# Altium project inno_Bottom_borad.PrjPcb
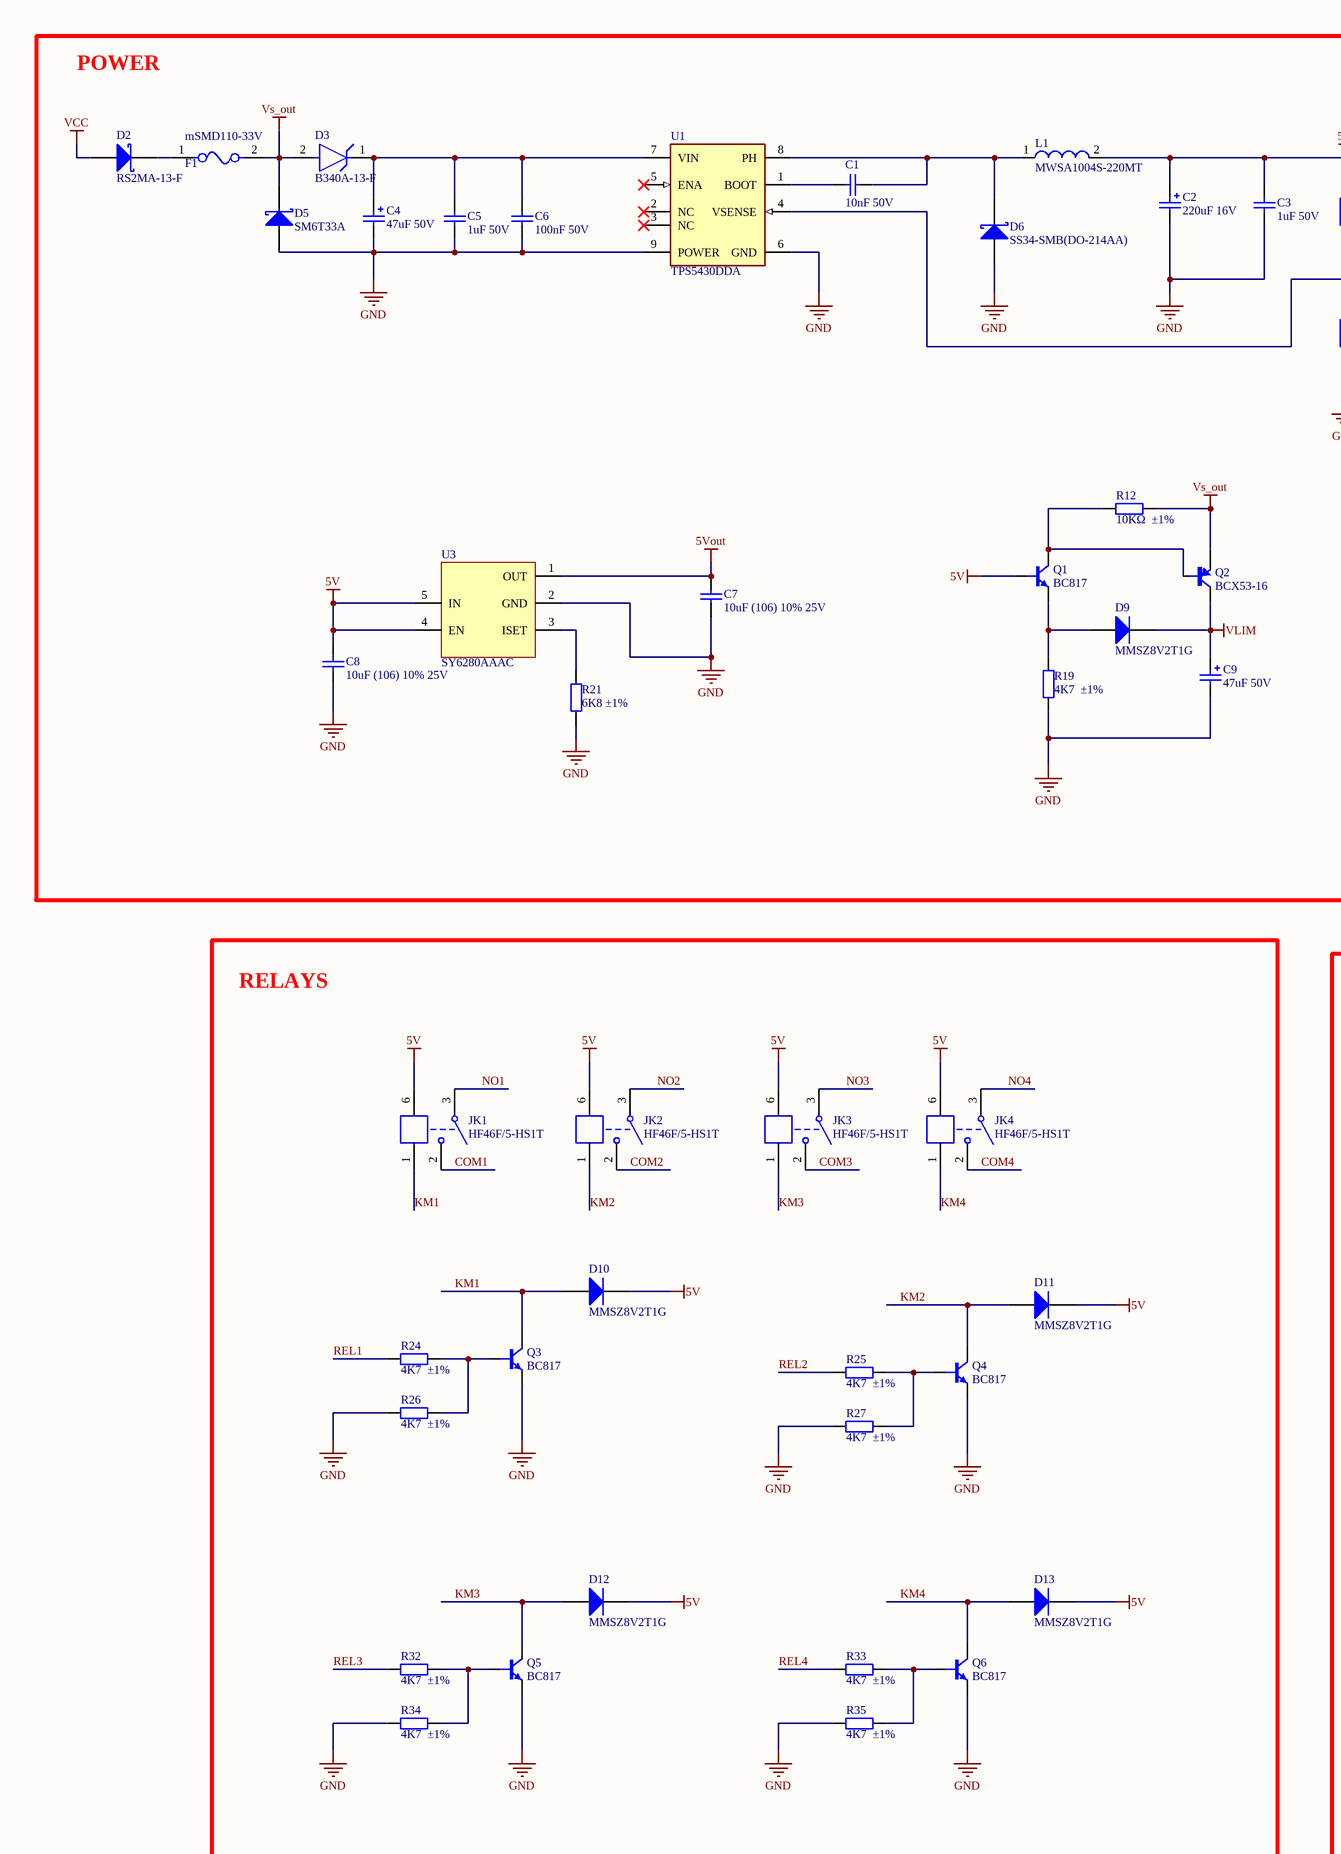
[diagram p0: BottomBoard.SchDoc, left]
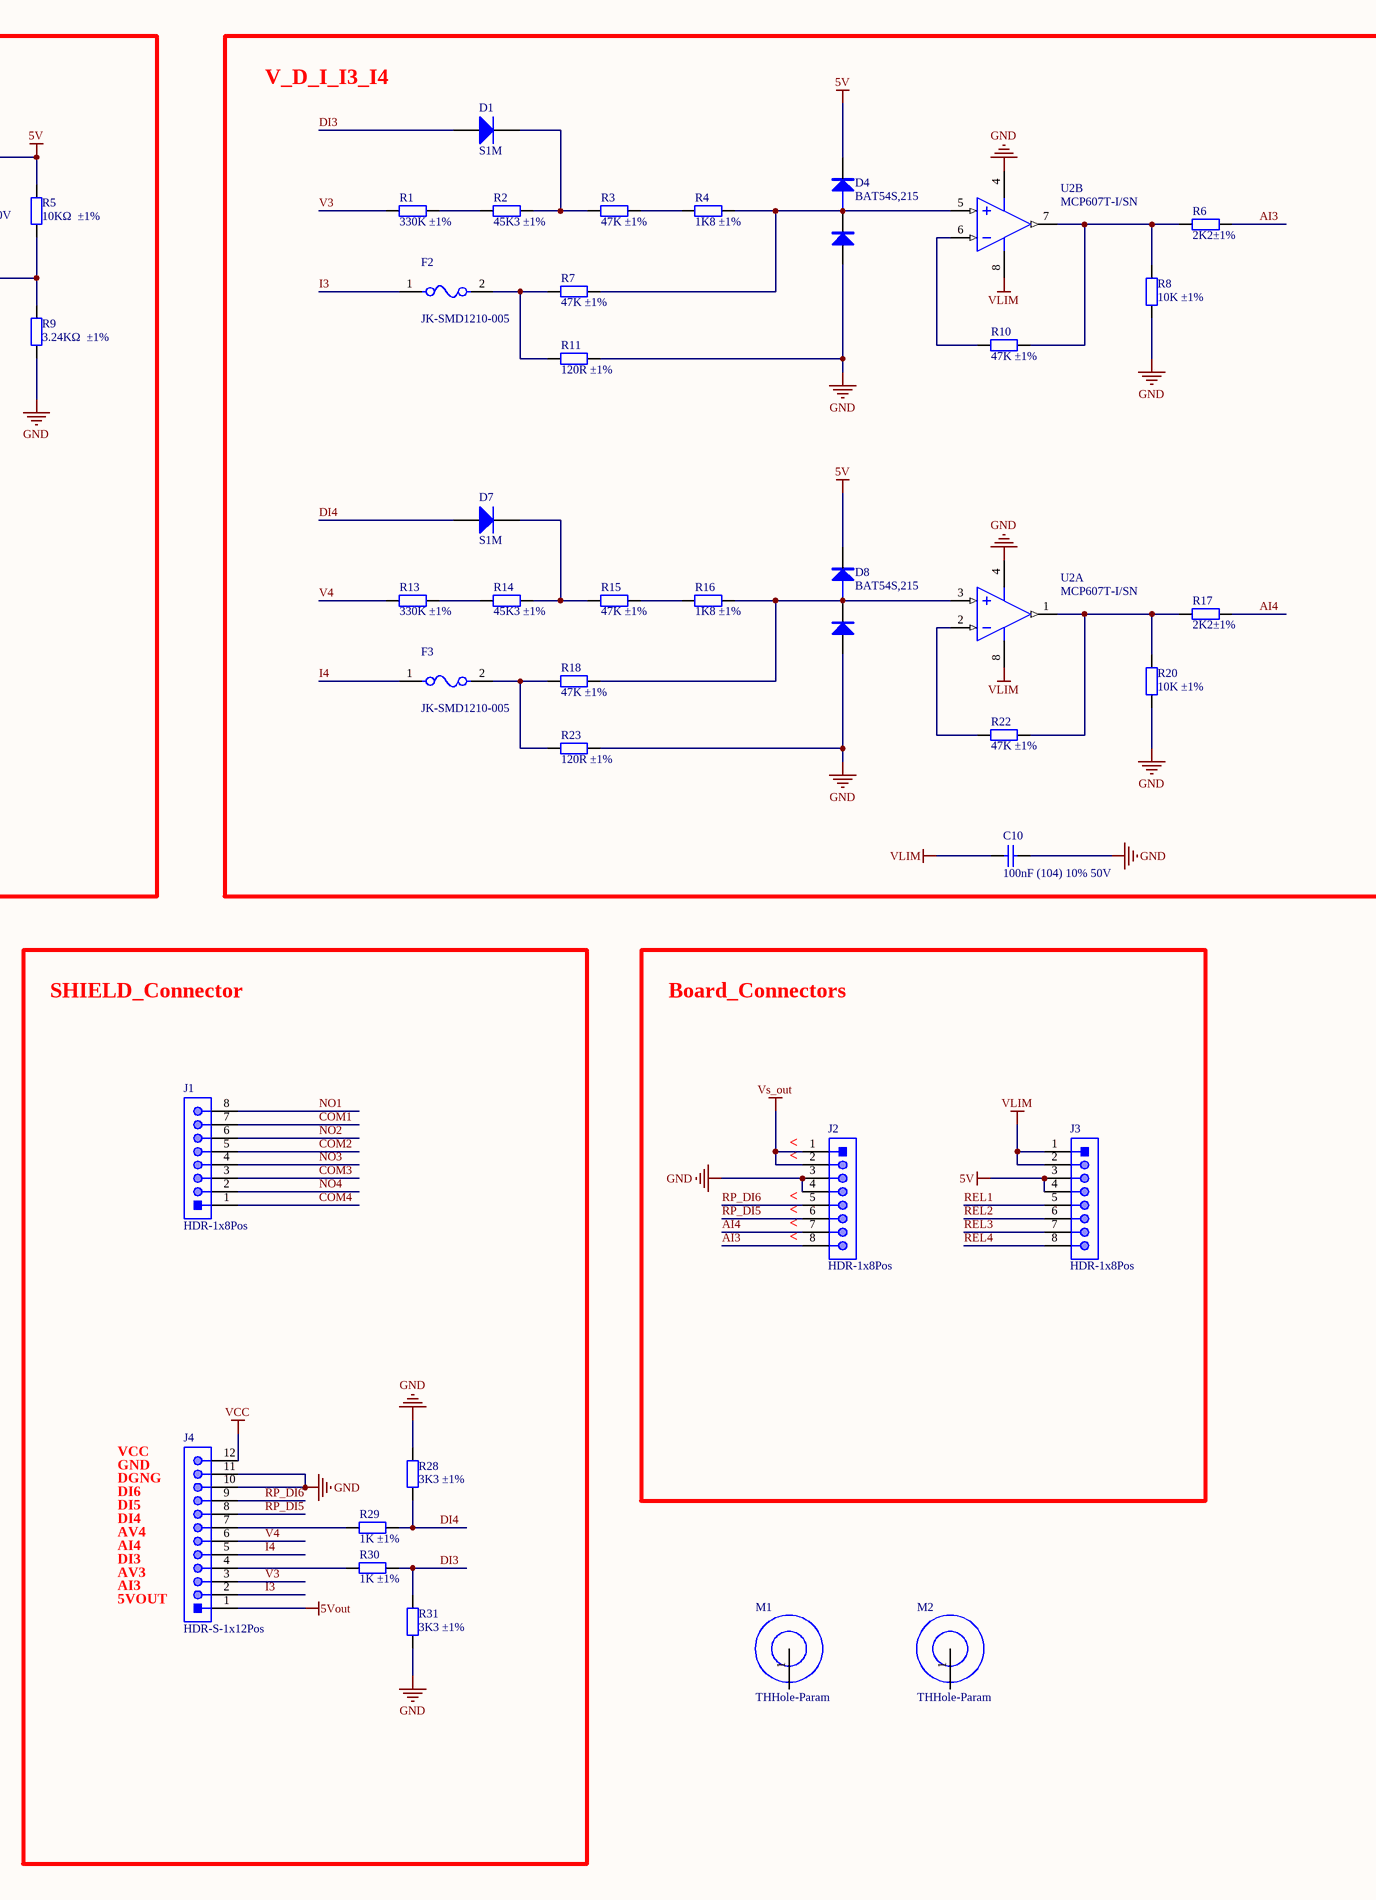
[diagram p1: BottomBoard.SchDoc, right]
2 sheets, 81 parts. Net scope: global (net labels, ports and power ports of the same name join across sheets).
Board file: iono_bottom_pico.PcbDoc
Sheets:
  SheetStruct.SchDoc
  BottomBoard.SchDoc

## Sheet SheetStruct.SchDoc
size A4

## Sheet BottomBoard.SchDoc
size A2

### Parts
C1  10nF 50V  [0402_C]
C2  220uF 16V  [SMD-EC-F8]
C3  1uF 50V  [0603_C]
C4  47uF 50V  [SMD-EC-F6.3]
C5  1uF 50V  [0603_C]
C6  100nF 50V  [0402_C]
C7  10uF (106) 10% 25V  [0603_C]
C8  10uF (106) 10% 25V  [0603_C]
C9  47uF 50V  [SMD-EC-F6.3]
C10  100nF (104) 10% 50V  [0402_C]
D1  S1M  [DO-214AC]
D2  RS2MA-13-F  [DIOD-SMA-1K]
D3  B340A-13-F  [DO-214AC]
D4  BAT54S,215  [SOT-23-3]
D5  SM6T33A  [DO-214AA]
D6  SS34-SMB(DO-214AA)  [DO-214AA]
D7  S1M  [DO-214AC]
D8  BAT54S,215  [SOT-23-3]
D9  MMSZ8V2T1G  [SOD-123-1A]
D10  MMSZ8V2T1G  [SOD-123-1A]
D11  MMSZ8V2T1G  [SOD-123-1A]
D12  MMSZ8V2T1G  [SOD-123-1A]
D13  MMSZ8V2T1G  [SOD-123-1A]
F1  mSMD110-33V  [1812_R]
F2  JK-SMD1210-005  [1210_R]
F3  JK-SMD1210-005  [1210_R]
J1  HDR-1x8Pos  [KF2EDG3.50-8H]
J2  HDR-1x8Pos  [Pin Header 1x8 TH Pitch 2.54mm]
J3  HDR-1x8Pos  [Pin Header 1x8 TH Pitch 2.54mm]
J4  HDR-S-1x12Pos  [KF2EDGK-2.54-WI-12P]
JK1  HF46F/5-HS1T  [RELAY-TH_HF46F-5-HS1T]
JK2  HF46F/5-HS1T  [RELAY-TH_HF46F-5-HS1T]
JK3  HF46F/5-HS1T  [RELAY-TH_HF46F-5-HS1T]
JK4  HF46F/5-HS1T  [RELAY-TH_HF46F-5-HS1T]
L1  MWSA1004S-220MT  [MWSA1004S]
M1  THHole-Param  [MTG300_600]
M2  THHole-Param  [MTG300_600]
Q1  BC817  [SOT-23-3]
Q2  BCX53-16  [SOT89_M]
Q3  BC817  [SOT-23-3]
Q4  BC817  [SOT-23-3]
Q5  BC817  [SOT-23-3]
Q6  BC817  [SOT-23-3]
R1  330K ±1%  [0402_R]
R2  45K3 ±1%  [0402_R]
R3  47K ±1%  [0402_R]
R4  1K8 ±1%  [0402_R]
R5  10KΩ  ±1%  [0402_R]
R6  2K2±1%  [0402_R]
R7  47K ±1%  [0402_R]
R8  10K ±1%  [0402_R]
R9  3.24KΩ  ±1%  [0402_R]
R10  47K ±1%  [0402_R]
R11  120R ±1%  [RS 1/4W-V3]
R12  10KΩ  ±1%  [0402_R]
R13  330K ±1%  [0402_R]
R14  45K3 ±1%  [0402_R]
R15  47K ±1%  [0402_R]
R16  1K8 ±1%  [0402_R]
R17  2K2±1%  [0402_R]
R18  47K ±1%  [0402_R]
R19  4K7  ±1%  [0402_R]
R20  10K ±1%  [0402_R]
R21  6K8 ±1%  [0402_R]
R22  47K ±1%  [0402_R]
R23  120R ±1%  [RS 1/4W-V3]
R24  4K7  ±1%  [0402_R]
R25  4K7  ±1%  [0402_R]
R26  4K7  ±1%  [0402_R]
R27  4K7  ±1%  [0402_R]
R28  3K3 ±1%  [0402_R]
R29  1K ±1%  [0402_R]
R30  1K ±1%  [0402_R]
R31  3K3 ±1%  [0402_R]
R32  4K7  ±1%  [0402_R]
R33  4K7  ±1%  [0402_R]
R34  4K7  ±1%  [0402_R]
R35  4K7  ±1%  [0402_R]
U1  TPS5430DDA  [DDA0008J_L]
U2  MCP607T-I/SN  [D0008A_L]  (parts A,B of 2)
U3  SY6280AAAC  [SOT-23-5]

### Blocks framed on the sheet
POWER: C1-C9 D2 D3 D5 D6 D9 F1 L1 Q1 Q2 R5 R9 R12 R19 R21 U1 U3
V_D_I_I3_I4: C10 D1 D4 D7 D8 F2 F3 R1-R4 R6-R8 R10 R11 R13-R18 R20 R22 R23 U2
RELAYS: D10-D13 JK1-JK4 Q3-Q6 R24-R27 R32-R35
SHIELD_Connector: J1 J4 R28-R31
Board_Connectors: J2 J3

### Nets
5V: C2.1 C3.2 C8.2 D4.2 D8.2 D10.1(K) D11.1(K) D12.1(K) D13.1(K) J3.3 J3.4 JK1.6 JK2.6 JK3.6 JK4.6 L1.2 Q1.1(B) R5.2 U3.4(EN) U3.5(IN)
5Vout: C7.2 J4.1 U3.1(OUT)
GND: C2.2 C3.1 C4.2 C5.1 C6.1 C7.1 C8.1 C9.2 C10.2 D4.1 D5.2(A) D6.2(A) D8.1 J2.3 J2.4 J4.10 J4.11 Q3.2(E) Q4.2(E) Q5.2(E) Q6.2(E) R8.2 R9.1 R11.1 R19.2 R20.2 R21.1 R23.1 R26.1 R27.1 R28.1 R31.1 R34.1 R35.1 U1.6(GND) U1.9(POWER) U2.4(GND) U3.2(GND)
VCC: D2.2(A) J4.12
VLIM: C9.1 C10.1 D9.1(K) J3.1 J3.2 Q2.3(C) U2.8(VCC)
Vs_out: D3.2(A) D5.1(K) F1.2 J2.1 J2.2 Q2.2(E) R12.1
AI3: J2.8 R6.2
AI4: J2.7 R17.2
COM1: J1.7 JK1.2
COM2: J1.5 JK2.2
COM3: J1.3 JK3.2
COM4: J1.1 JK4.2
DI3: D1.2(A) R30.2 R31.2
DI4: D7.2(A) R28.2 R29.2
I3: F2.1 J4.2
I4: F3.1 J4.5
KM1: D10.2(A) JK1.1 Q3.3(C)
KM2: D11.2(A) JK2.1 Q4.3(C)
KM3: D12.2(A) JK3.1 Q5.3(C)
KM4: D13.2(A) JK4.1 Q6.3(C)
NO1: J1.8 JK1.3
NO2: J1.6 JK2.3
NO3: J1.4 JK3.3
NO4: J1.2 JK4.3
REL1: J3.5 R24.1
REL2: J3.6 R25.1
REL3: J3.7 R32.1
REL4: J3.8 R33.1
RP_DI5: J2.6 J4.8
RP_DI6: J2.5 J4.9
V3: J4.3 R1.2
V4: J4.6 R13.2
NetC1_1: C1.1 D6.1(K) L1.1 U1.8(PH)
NetC1_2: C1.2 U1.1(BOOT)
NetC4_1: C4.1 C5.2 C6.2 D3.1(C) U1.7(VIN)
NetD1_1: D1.1(K) R2.1 R3.2
NetD2_1: D2.1(K) F1.1
NetD4_3: D4.3 R4.1 R7.1 U2.5(2IN+)
NetD7_1: D7.1(K) R14.1 R15.2
NetD8_3: D8.3 R16.1 R18.1 U2.3(1IN+)
NetD9_2: D9.2(A) Q1.2(E) R19.1
NetF2_2: F2.2 R7.2 R11.2
NetF3_2: F3.2 R18.2 R23.2
NetJ4_4: J4.4 R30.1
NetJ4_7: J4.7 R29.1
NetQ1_3: Q1.3(C) Q2.1(B) R12.2
NetQ3_1: Q3.1(B) R24.2 R26.2
NetQ4_1: Q4.1(B) R25.2 R27.2
NetQ5_1: Q5.1(B) R32.2 R34.2
NetQ6_1: Q6.1(B) R33.2 R35.2
NetR1_1: R1.1 R2.2
NetR3_1: R3.1 R4.2
NetR5_1: R5.1 R9.2 U1.4(VSENSE)
NetR6_1: R6.1 R8.1 R10.1 U2.7(2OUT)
NetR10_2: R10.2 U2.6(2IN-)
NetR13_1: R13.1 R14.2
NetR15_1: R15.1 R16.2
NetR17_1: R17.1 R20.1 R22.1 U2.1(1OUT)
NetR21_2: R21.2 U3.3(ISET)
NetR22_2: R22.2 U2.2(1IN-)

Not connected (* = marked no-connect by the designer): M1 1; M2 1; U1 2(NC)* 3(NC)* 5(ENA)*

### Notes on the sheet
- (near J2) <
- VCC
- GND
- DGNG
- DI6
- DI5
- DI4
- AV4
- AI4
- DI3
- AV3
- AI3
- 5VOUT

### Library data of the parts
C1 C6 C10 = 0402 100nF (104) 10% 16V: 贴片电容; ComponentLink1Description: 供应商链接; ComponentLink1URL: http://www.szlcsc.com/product/details_1877.html; Package: 0402; Supplier: LC; SuppliersPartNumber: C1525
C2 = Alu-220uF 25V-F8: 贴片铝电解电容 8x10.2mm; ComponentLink1Description: 供应商链接; ComponentLink1URL: https://item.szlcsc.com/430227.html; Package: SMD,8x10.2mm; Supplier: LC; SuppliersPartNumber: C371974; ComponentLink2Description: Datasheet; ComponentLink2URL: https://atta.szlcsc.com/upload/public/pdf/source/20191008/C433299_BF0078E27B9DA48549195598248CF336.pdf
C3 C5 C7 C8 = 0603 10uF (106) 10% 10V: 贴片电容; ComponentLink1Description: 供应商链接; ComponentLink1URL: http://www.szlcsc.com/product/details_20411.html; Package: 0603; Supplier: LC; SuppliersPartNumber: C19702
C4 C9 = Alu-100uF 25V: 贴片铝电解电容; ComponentLink1Description: 供应商链接; ComponentLink1URL: https://item.szlcsc.com/3729.html; Package: SMD,6.3x7.7mm; Supplier: LC; SuppliersPartNumber: C3338; ComponentLink2Description: Datasheet; ComponentLink2URL: https://atta.szlcsc.com/upload/public/pdf/source/20160816/1471342948700.pdf
D1 D7 = B5817WS-TP: 肖特基二极管; Manufacturer: MCC; Forward Voltage: 450mV; Max Reverse Current: 1mA; Average Rectified Current: 1A; Max Repetitive Reverse Voltage (Vrrm): 20V; Max Forward Surge Current (Ifsm): 10A; Element Configuration: Single; Supplier 1: Digi-Key; Manufacturer Part Number: B5817WS-TP; RoHS: Yes; Category: Rectifier Diodes; Stock 1: 47317; Pricing 1: 1=0.43000, 10=0.30300, 100=0.15310, 500=0.12486, 1000=0.09264 (USD); Mount: Surface Mount; Number of Pins: 2; Max Operating Temperature: 125°C; Packaging: Tape and Reel; Package Quantity: 1; Forward Current: 1A; Max Reverse Voltage (DC): 20V; REACH SVHC: Unknown; Lead Free: Lead Free; RoHS Compliant: Yes; ComponentLink1URL: https://datasheet.ciiva.com/912/b5817ws-b5819wssod-323-912713.pdf?src-supplier=Digi-Key; ComponentLink1Description: https://datasheet.ciiva.com/912/b5817ws-b5819wssod-323-912713.pdf?src-supplier=Digi-Key; ComponentLink2URL: https://datasheet.ciiva.com/7624/b5817ws-b5819wssod-323-7624698.pdf?src-supplier=Element14; ComponentLink2Description: https://datasheet.ciiva.com/7624/b5817ws-b5819wssod-323-7624698.pdf?src-supplier=Element14; ComponentLink3URL: https://datasheet.ciiva.com/912/b5817ws-b5819wssod-323-912711.pdf?src-supplier=Digi-Key; ComponentLink3Description: https://datasheet.ciiva.com/912/b5817ws-b5819wssod-323-912711.pdf?src-supplier=Digi-Key; ComponentLink4URL: https://datasheet.ciiva.com/912/b5817ws-b5819wssod-323-912712.pdf?src-supplier=Digi-Key; ComponentLink4Description: https://datasheet.ciiva.com/912/b5817ws-b5819wssod-323-912712.pdf?src-supplier=Digi-Key; ComponentLink5URL: https://datasheet.ciiva.com/17182/b5817ws-b5819wssod-323-17182367.pdf?src-supplier=Future+Electronics; ComponentLink5Description: https://datasheet.ciiva.com/17182/b5817ws-b5819wssod-323-17182367.pdf?src-supplier=Future+Electronics; Supplier Part Number 1: B5817WS-TPMSCT-ND
D2 = B230A-13-F: B230A-13-F,SCHOTTKY RECTIFIER; Manufacturer: Diodes; Element Configuration: Single; Max Repetitive Reverse Voltage (Vrrm): 30V; Forward Current: 2A; Peak Non-Repetitive Surge Current: 50A; Peak Reverse Current: 500uA; Forward Voltage: 500mV; Polarity: Standard; Capacitance: 200pF; Supplier 1: Digi-Key; Manufacturer Part Number: B230A-13-F; RoHS: Yes; Category: Rectifier Diodes; Stock 1: 36331; Pricing 1: 1=0.45000, 10=0.33900, 25=0.30560, 100=0.16110, 250=0.15944, 500=0.14276, 1000=0.11110, 2500=0.10166 (USD); Mount: Surface Mount; Case/Package: SMA; Number of Pins: 2; Weight: 0.002258oz; Contact Plating: Tin,Matte; Min Operating Temperature: -65°C; Max Operating Temperature: 150°C; Packaging: Tape and Reel; Current Rating: 2A; Max Forward Surge Current (Ifsm): 50A; Max Reverse Voltage (DC): 30V; Average Rectified Current: 2A; Output Current: 2A; Package Quantity: 5000; Termination: SMD/SMT; Voltage Rating (DC): 30V; Length: 4.6mm; Height: 2.1mm; Width: 2.92mm; Radiation Hardening: No; Lead Free: Lead Free; REACH SVHC: No SVHC; ComponentLink1URL: https://datasheet.ciiva.com/27052/1538769-27052351.pdf?src-supplier=Jameco; ComponentLink1Description: https://datasheet.ciiva.com/27052/1538769-27052351.pdf?src-supplier=Jameco; ComponentLink2URL: https://datasheet.ciiva.com/16289/ds13004-16289654.pdf?src-supplier=Future+Electronics; ComponentLink2Description: https://datasheet.ciiva.com/16289/ds13004-16289654.pdf?src-supplier=Future+Electronics; ComponentLink3URL: https://datasheet.ciiva.com/8301/ds13004-8301593.pdf?src-supplier=Avnet; ComponentLink3Description: https://datasheet.ciiva.com/8301/ds13004-8301593.pdf?src-supplier=Avnet; ComponentLink4URL: https://datasheet.ciiva.com/4715/ds13004-70120-4715546.pdf?src-supplier=Mouser; ComponentLink4Description: https://datasheet.ciiva.com/4715/ds13004-70120-4715546.pdf?src-supplier=Mouser; ComponentLink5URL: https://datasheet.ciiva.com/22695/1911814-22695786.pdf?src-supplier=Element14; ComponentLink5Description: https://datasheet.ciiva.com/22695/1911814-22695786.pdf?src-supplier=Element14; Supplier Part Number 1: B230A-FDICT-ND
D3 = SMAJ16A: Transient Voltage Suppressor, 6.40 to 231 V, 16 V Stand-off Voltage, Uni-Directional, -55 to 155 degC, 2-pin DO-214AC, Pb-Free, Tape and Reel; PartNumber: SMAJ16A-E3/61; Manufacturer: Vishay Semiconductor; VBR Uni-Directional (V): 6.4 to 231; VWM (V): 16; ID (uA): 1; IFSM: 40 A; PPPM (W): 400, 300; Packing: Tape and Reel; Operating Junction and Storage Temperature Range: -55 to 150 degC; Mounting Technology: Surface Mount; DatasheetVersion: 12/8/2013; PackageReference: DO-214AC-2; PackageDescription: 2-Pin DO-214AC (SMA), Body 4.245 x 2.665 mm; ComponentLink1Description: Manufacturer URL; RoHS: TRUE; ComponentLink3URL: http://www.vishay.com/docs/88390/smaj50a.pdf; ComponentLink1URL: http://www.vishay.com/; ComponentLink3Description: Package Specification; ComponentLink2Description: Datasheet; ComponentLink2URL: http://www.vishay.com/docs/88390/smaj50a.pdf
D4 D8 = BAT54S,215: 肖特基二极管
D5 D6 = SS34-SMB: 3A 肖特基二极管
D9-D13 = 1N4148W-7-F: Fast Switching Diode, 100 V, 0.15 A, -65 to 150 degC, 2-Pin?SOD123, RoHS, Tape and Reel; Recovery Time: 4ns; Brand: DiodesIncorporated; Unit Weight: 0.000353oz; Max Surge Current: 2A; Peak Reverse Voltage: 100V; Ir - Reverse Current: 1uA; Vf - Forward Voltage: 1.25V; Configuration: Single; If - Forward Current: 0.15A; Product Category: Diodes-GeneralPurpose,Power,Switching; Operating Temperature Range: -65Cto+150C; Packaging: Reel; Manufacturer URL: http://www.diodes.com/; Maximum Operating Temperature: +150C; Height: 1.25mm; Minimum Operating Temperature: -65C; Product: SwitchingDiodes; Package URL: http://www.diodes.com/datasheets/ds18004.pdf; Type: SwitchingDiode; Package Reference: SOD123-2; Width: 1.7mm; Datasheet URL: http://www.farnell.com/datasheets/1915529.pdf; Datasheet Version: Rev. 24-2, 10/2013; Series: 1N4148; Factory Pack Quantity: 3000; Length: 2.85mm; RoHS: True; Manufacturer: DiodesIncorporated; Mounting Style: SMD/SMT; Package / Case: SOD-123
F1-F3 = Fuse 2A 0805: 贴片保险，自恢复
J1-J3 = HDR-1x8Pos: 2.54mm 排针
J4 = HDR-S-1x12Pos: 2.54mm 排座
JK1-JK4 = HF46F/5-HS1T: 5V一组常开
L1 = MWSA1004S-220MT: 功率电感; ManufacturerPartNumber: MWSA1004S-470MT; Value: 2.2uH; Brand: SUNLORD 顺络; Supplier: JLC; SupplierPartNumber: C408489; ComponentLink1Description: Datasheet; ComponentLink1URL: https://atta.szlcsc.com/upload/public/pdf/source/20180125/C167121_15168650534691302955.pdf
M1 M2 = MHole-1: 金属化可接地固定孔
Q1 Q3-Q6 = BC817: NPN贴片三极管; SuplierNumber: C2150; Datasheet: https://item.szlcsc.com/2507.html
Q2 = BCX53-16: PNP贴片三极管; SuplierNumber: C2150; Datasheet: https://item.szlcsc.com/2507.html
R1-R35 = 0402 1.2KΩ (1201) 1%: 贴片电阻; ComponentLink1Description: 供应商链接; ComponentLink1URL: http://www.szlcsc.com/product/details_26605.html; Package: 0402; Supplier: LC; SuppliersPartNumber: C25862
U1 = TPS5430DDA: 5.5V to 36V Input, 3A, 500kHz Step-Down Converter 8-SO PowerPAD 0 to 0; Manufacturer: Texas Instruments; Output Voltage: 31V; Number of Outputs: 1; Synchronous Rectifier: No; Output Type: Adjustable; Quiescent Current: 3mA; Min Output Voltage: 1.22V; Efficiency: 95%; Supplier 1: Digi-Key; Manufacturer Part Number: TPS5430DDA; RoHS: Yes; Category: Voltage Regulators - Switching; Stock 1: 5474; Pricing 1: 1=4.62000, 10=4.14600, 25=3.91960, 100=3.22270, 250=2.89172, 500=2.78720, 1000=2.31686, 2500=2.22976 (USD); Mount: Surface Mount; Case/Package: SOIC; Number of Pins: 8; Weight: 0.00249oz; Min Operating Temperature: -40°C; Max Operating Temperature: 125°C; Switching Frequency: 500kHz; Output Current: 3A; Package Quantity: 75; Packaging: Rail/Tube; Min Input Voltage: 5.5V; Max Input Voltage: 36V; Max Output Voltage: 31V; Max Output Current: 3A; Operating Supply Voltage: 36V; Length: 5mm; Height: 1.55mm; Width: 4mm; Radiation Hardening: No; Lead Free: Lead Free; REACH SVHC: No SVHC; ComponentLink1URL: https://datasheet.ciiva.com/15113/getdatasheetpartid-234473-15113424.pdf?src-supplier=Verical; ComponentLink1Description: https://datasheet.ciiva.com/15113/getdatasheetpartid-234473-15113424.pdf?src-supplier=Verical; ComponentLink2URL: https://datasheet.ciiva.com/27051/1113074-27051458.pdf?src-supplier=Jameco; ComponentLink2Description: https://datasheet.ciiva.com/27051/1113074-27051458.pdf?src-supplier=Jameco; ComponentLink3URL: https://datasheet.ciiva.com/26896/tps5430dda-26896658.pdf?src-supplier=IIIC; ComponentLink3Description: https://datasheet.ciiva.com/26896/tps5430dda-26896658.pdf?src-supplier=IIIC; ComponentLink4URL: https://datasheet.ciiva.com/26098/tps5430-26098807.pdf?src-supplier=Avnet+Europe; ComponentLink4Description: https://datasheet.ciiva.com/26098/tps5430-26098807.pdf?src-supplier=Avnet+Europe; ComponentLink5URL: https://datasheet.ciiva.com/7993/1849779-7993829.pdf?src-supplier=Element14; ComponentLink5Description: https://datasheet.ciiva.com/7993/1849779-7993829.pdf?src-supplier=Element14; ComponentLink6URL: https://datasheet.ciiva.com/2026/tps5431-2026795.pdf?src-supplier=Digi-Key; ComponentLink6Description: https://datasheet.ciiva.com/2026/tps5431-2026795.pdf?src-supplier=Digi-Key; Supplier Part Number 1: 296-19447-5-ND
U2 = TI-LM358DR: Dual Operational Amplifier, 3 to 32 V, 0 to 70 degC, 8-Pin SOIC (D), Green (RoHS & no Sb/Br), Tape and Reel; DatasheetVersion: SLOS068T, 04/2015; ComponentLink1URL: http://www.ti.com/; ComponentLink2URL: http://www.ti.com/lit/ds/symlink/lm358.pdf; ComponentLink3Description: Package Specification; Code_JEDEC: MS-012; PackageDescription: 8-Pin Small Outline Integrated Circuit, Body 4.9 x 3.9 mm, Pitch 1.27 mm; ComponentLink2Description: Datasheet; PackageVersion: 4040047-3/M, 06/2011; ComponentLink1Description: Manufacturer URL; ComponentLink3URL: http://www.ti.com/lit/ml/msoi002j/msoi002j.pdf; PackageReference: D0008A
U3 = SY6280AAAC: USB电子开关，电流保护